# Altium schematic sheet pca10040_sheet7_power_supply.SchDoc: PCA10040 - Power Supply
size A4; Organization: Nordic Semiconductor; DocumentNumber: 7; Revision: 1.2.1; SheetNumber: 7; SheetTotal: 7; CompanyName: Nordic Semiconductor; DrawnBy: KJP/RUBR; ProjectNumber: 4397; PCBRevision: 0256RUBR; DocumentSize: A4; PCAName: PCA10040; PCBNumber: 400150; ProjectName: Quark
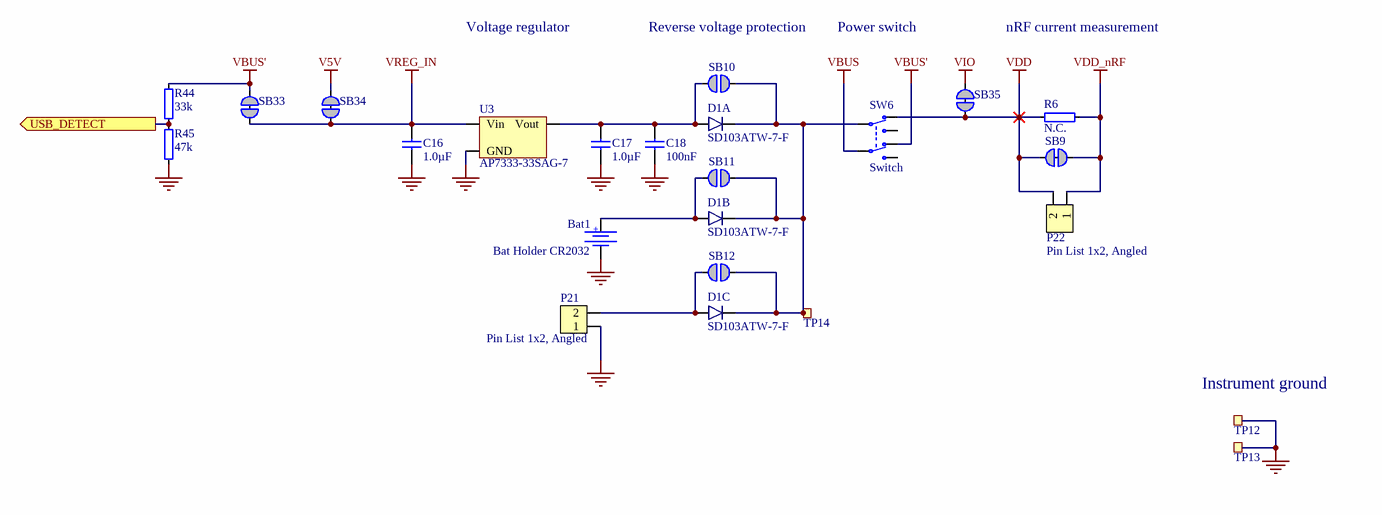
[diagram p0: pca10040_sheet7_power_supply.SchDoc]

## Parts
Bat1  Bat Holder CR2032  [CR2032_HOLDER_SMD]
C16  1.0µF  [CAPC1608X06L]
C17  1.0µF  [CAPC1608X06L]
C18  100nF  [CAPC1005X04L]
D1  SD103ATW-7-F  [SOT-363]  (parts A,B,C of 3)
P21  Pin List 1x2, Angled  [LIST_ANG_1x2-SMD-2.54MM]
P22  Pin List 1x2, Angled  [LIST_ANG_1x2-SMD-2.54MM]
R6  N.C.  [RESC1005X04L]
R44  33k  [RESC1005X04L]
R45  47k  [RESC1005X04L]
SB9  Solderbridge  [Solderbridge_Shorted]  (value not drawn)  (net tie, no BOM)
SB10  Solderbridge  [Solderbridge]  (value not drawn)  (no BOM)
SB11  Solderbridge  [Solderbridge]  (value not drawn)  (no BOM)
SB12  Solderbridge  [Solderbridge]  (value not drawn)  (no BOM)
SB33  Solderbridge  [Solderbridge_Shorted_Power]  (value not drawn)  (net tie, no BOM)
SB34  Solderbridge  [Solderbridge_Shorted_Power]  (value not drawn)  (net tie, no BOM)
SB35  Solderbridge  [Solderbridge_Shorted_Power]  (value not drawn)  (net tie, no BOM)
SW6  Switch  [Switch-Slide-DPDT-8.5x3.6mm]
TP12  TP  [TESTPAD-TH]  (value not drawn)  (no BOM)
TP13  TP  [TESTPAD-TH]  (value not drawn)  (no BOM)
TP14  Ø1.0mm,SMD  [TP_SMD_Ø1.0mm]  (value not drawn)  (no BOM)
U3  AP7333-33SAG-7  [SOT-23A]

## Ports
USB_DETECT (out)

## Nets
GND: Bat1.2 C16.1 C17.1 C18.1 P21.1 R45.1 TP12.1 TP13.1 U3.3(GND)
V5V: SB34.1
VBUS: SW6.5(COM-2)
VBUS': R44.2 SB33.1 SW6.6(N.C-2)
VDD: P22.2 R6.1 SB9.2 SB35.2 SW6.3(N.C-1)
VDD_nRF: P22.1 R6.2 SB9.1
VIO: SB35.1
VREG_IN: C16.2 SB33.2 SB34.2 U3.1(Vin)
USB_DETECT: R44.1 R45.2 ; port USB_DETECT
NetBat1_1: Bat1.1 D1.5(A2) SB11.2
NetC17_2: C17.2 C18.2 D1.6(A1) SB10.2 U3.2(Vout)
NetD1_1: D1.1(C1) D1.2(C2) D1.3(C3) SB10.1 SB11.1 SB12.1 SW6.2(COM-1) TP14.1
NetD1_4: D1.4(A3) P21.2 SB12.2

Not connected (* = marked no-connect by the designer): SW6 1(N.O-1) 4(N.O-2)

## Notes on the sheet
- Voltage regulator
- (near SB10) Reverse voltage protection
- Power switch
- nRF current measurement
- (near TP12) Instrument ground
- Title
- Size
- Date:
- Project Number
- Sheet         of
- Revision
- File:
- Drawn By:
- (in symbol Bat Holder CR2032 SMD) +

## Library data of the parts
Bat1 = Bat Holder CR2032 SMD: Manufacturer: Comfortable; Manufacturer Part Number: BC-2001; 2nd source part number: 165-0693; Artikkelnr Noca: 55089011; Artikkelnr Simpro: N.A.; Part Number: Bat Holder CR2032 SMD; Datasheet: \\hizz\pro\app9717\Datasheet\connectores\Comfortable\BC-2001.pdf; Footprint Doc: CR2032_HOLDER_SMD; LatestRevisionDate: 2016-04-21; Pin Count: 3; Publisher: Nordic Semiconductor; Published: 2009-12-12; Value: Bat Holder CR2032; Note: Bat Holder CR2032; Supplier: Cabcon; Supplier part number: BC-2001/T & R; 2nd source Supplier: Farnell
C16 C17 = C0603-1µ0: Capacitor, X7R, ±10%; Part number IPS: 00000000616; Note: 16V; Artikkelnr Noca: 20039335; Artikkelnr Simpro: N.A.; Published: 2009-05-08; LatestRevisionDate: 2013-06-05; Publisher: Nordic Semiconductor; Value: 1.0µF; Part Number: C0603-1µ0; Manufacturer: *; Manufacturer Part Number: *; Datasheet: *; Pin Count: 2; Supplier: *; Supplier part number: *; 2nd source Supplier: *; 2nd source part number: *; Footprint Doc: 0603
C18 = C0402-100n: Capacitor, X7R, ±10%; Part number IPS: 00000005296; Note: 16V; Artikkelnr Noca: 20039200; Artikkelnr Simpro: N.A.; Published: 2009-05-08; LatestRevisionDate: 2009-11-23; Publisher: Nordic Semiconductor; Value: 100nF; Part Number: C0402-100n; Manufacturer: *; Manufacturer Part Number: *; Datasheet: *; Pin Count: 2; Supplier: *; Supplier part number: *; 2nd source Supplier: *; 2nd source part number: *; Footprint Doc: 0402
D1 = SD103ATW-7-F: Surface Mount Schottky Barrier Diode Array; Manufacturer: Diodes Incorporated; 2nd source part number: 177-3507; Artikkelnr Noca: 10029109; Artikkelnr Simpro: N.A.; Part Number: SD103ATW-7-F; Manufacturer Part Number: SD103ATW-7-F; Datasheet: http://www.diodes.com/datasheets/ds30374.pdf; LatestRevisionDate: 2012-06-15; Publisher: Nordic Semiconductor; Published: 2012-06-15; Value: SD103ATW-7-F; Note: *; Supplier: Digi-Key; Supplier part number: SD103ATW-FDITR-ND; 2nd source Supplier: Farnell; Footprint Doc: SOT-363
P21 P22 = Pin List Ang 1x2 SMD, 2.54mm: Pin List 1x2, 2.54mm (100mil), Right Angled, SMD; Manufacturer: W-CON; Manufacturer Part Number: 1125B-1102S0Z135R2; 2nd source part number: TSM-102-01-L-SH-A; Artikkelnr Noca: 55010023; Artikkelnr Simpro: N.A.; Part Number: Pin List Ang 1x2 SMD, 2.54mm; Datasheet: \\hizz\pro\app9717\Datasheet\connectores\W-CON\1125B-11XXXXZXXXXX.pdf; Footprint Doc: LIST_ANG_1x2-SMD-2.54MM; LatestRevisionDate: 2016-05-26; Pin Count: 2; Publisher: Nordic Semiconductor; Published: 2016-01-22; Value: Pin List 1x2, Angled; Note: *; Supplier: Cabcon; Supplier part number: 1125B-1102S0Z135R2; 2nd source Supplier: Samtec
R6 = R0402-N.C.: Not mounted; Note: Chip Res; Artikkelnr Noca: N.A.; Assembly: Not mounted; Part Number: R0402-N.C.; Manufacturer: *; Manufacturer Part Number: *; Datasheet: *; LatestRevisionDate: 2009-05-08; Pin Count: 2; Publisher: Nordic Semiconductor; Published: 2009-05-08; Value: N.C.; Supplier: *; Supplier part number: *; 2nd source Supplier: *; 2nd source part number: *; Footprint Doc: 0402; Artikkelnr Simpro: N.A.
R44 = R0402-33k: Resistor, ±1%, 0.063W; Note: Chip Res 1%; Artikkelnr Noca: 27049109; Artikkelnr Simpro: N.A.; Value Ohm: 33000; Part Number: R0402-33k; Manufacturer: *; Manufacturer Part Number: *; Datasheet: *; LatestRevisionDate: 2009-11-23; Pin Count: 2; Publisher: Nordic Semiconductor; Published: 2009-05-08; Value: 33k; Supplier: Farnell; Supplier part number: 173-8870; 2nd source Supplier: *; 2nd source part number: *; Footprint Doc: 0402
R45 = R0402-47k: Resistor, ±1%, 0.063W; Note: Chip Res 1%; Artikkelnr Noca: 27049113; Artikkelnr Simpro: N.A.; Value Ohm: 47000; Part Number: R0402-47k; Manufacturer: *; Manufacturer Part Number: *; Datasheet: *; LatestRevisionDate: 2009-11-23; Pin Count: 2; Publisher: Nordic Semiconductor; Published: 2009-05-08; Value: 47k; Supplier: Farnell; Supplier part number: 146-9719; 2nd source Supplier: *; 2nd source part number: *; Footprint Doc: 0402
SB9 = Solderbridge Shorted: Shorted Solderbridge; Artikkelnr Noca: N.A.; Part Number: Solderbridge Shorted; Manufacturer: *; Manufacturer Part Number: *; Datasheet: *; LatestRevisionDate: 2012-08-07; Pin Count: 2; Publisher: Nordic Semiconductor; Published: 2012-08-07; Value: Solderbridge; Note: *; Supplier: *; Supplier part number: *; 2nd source Supplier: *; 2nd source part number: *; Footprint Doc: Solderbridge_Shorted; Artikkelnr Simpro: N.A.
SB10-SB12 = Solderbridge: Artikkelnr Noca: N.A.; Part Number: Solderbridge; Manufacturer: *; Manufacturer Part Number: *; Datasheet: *; LatestRevisionDate: 2009-12-14; Pin Count: 2; Publisher: Nordic Semiconductor; Published: 2009-12-14; Value: Solderbridge; Note: *; Supplier: *; Supplier part number: *; 2nd source Supplier: *; 2nd source part number: *; Footprint Doc: Solderbridge; Artikkelnr Simpro: N.A.
SB33-SB35 = Solderbridge Shorted Power: Shorted Solderbridge Power; Artikkelnr Noca: N.A.; Part Number: Solderbridge Shorted Power; Manufacturer: *; Manufacturer Part Number: *; Datasheet: *; LatestRevisionDate: 2012-08-07; Pin Count: 2; Publisher: Nordic Semiconductor; Published: 2012-08-07; Value: Solderbridge; Note: *; Supplier: *; Supplier part number: *; 2nd source Supplier: *; 2nd source part number: *; Footprint Doc: Solderbridge_Shorted_Power; Artikkelnr Simpro: N.A.
SW6 = Switch-Slide-DPDT-8.5x3.6mm: SMD slide Switch (ON-ON); Manufacturer: Dailywell; Manufacturer Part Number: SS206VM-G2-LLR-R; 2nd source part number: 401-2002-1-ND; Artikkelnr Noca: 50019107; Artikkelnr Simpro: N.A.; Part Number: Switch-Slide-DPDT-8.5x3.6mm; Datasheet: \\hizz\pro\app9717\Datasheet\switches\Dailywell\SS206VM-G2-LLR-R.pdf; Footprint Doc: Switch-Slide-DPDT-8.5x3.6mm; LatestRevisionDate: 2016-04-21; Pin Count: 6; Publisher: Nordic Semiconductor; Published: 2014-06-24; Value: Switch; Note: *; Supplier: Cabcon; Supplier part number: SS206VM-G2-LLR-R; 2nd source Supplier: Digi-Key
TP12 TP13 = Testpoint TH: Testpoint, through hole; Artikkelnr Noca: N.A.; Part Number: Testpoint TH; Manufacturer: *; Manufacturer Part Number: *; Datasheet: *; Footprint Doc: TESTPAD-TH; LatestRevisionDate: 2009-12-12; Pin Count: 1; Publisher: Nordic Semiconductor; Published: 2009-12-12; Value: TP; Note: *; Supplier: *; Supplier part number: *; 2nd source Supplier: *; 2nd source part number: *; Artikkelnr Simpro: N.A.
TP14 = TP_SMD_Ø1.0MM: 1.0mm circular SMD testpad; Manufacturer: Nordic Semiconductor; Artikkelnr Noca: N.A.; Part Number: TP_SMD_Ø1.0MM; Manufacturer Part Number: *; Datasheet: *; LatestRevisionDate: 2013-06-11; Pin Count: 1; Publisher: Nordic Semiconductor; Published: 2013-06-11; Value: Ø1.0mm,SMD; Note: *; Supplier: *; Supplier part number: *; 2nd source Supplier: *; 2nd source part number: *; Footprint Doc: TP_SMD_Ø1.0mm; Artikkelnr Simpro: N.A.
U3 = AP7333-33SAG-7: 300mA, Low Quiescent Current, Fast Transient Low Dropout Linear Regulator; Manufacturer: Diodes Incorporated; Artikkelnr Noca: 17039216; Artikkelnr Simpro: N.A.; Part Number: AP7333-33SAG-7; Manufacturer Part Number: AP7333-33SAG-7; Datasheet: http://www.diodes.com/datasheets/AP7333.pdf; LatestRevisionDate: 2012-06-15; Pin Count: 3; Publisher: Nordic Semiconductor; Published: 2012-06-15; Value: AP7333-33SAG-7; Note: *; Supplier: Digi-Key; Supplier part number: AP7333-33SAG-7DICT-ND; 2nd source Supplier: *; 2nd source part number: *; Footprint Doc: SOT-23-3